# Altium project BYU SAE Formula E 2025.PrjPcb
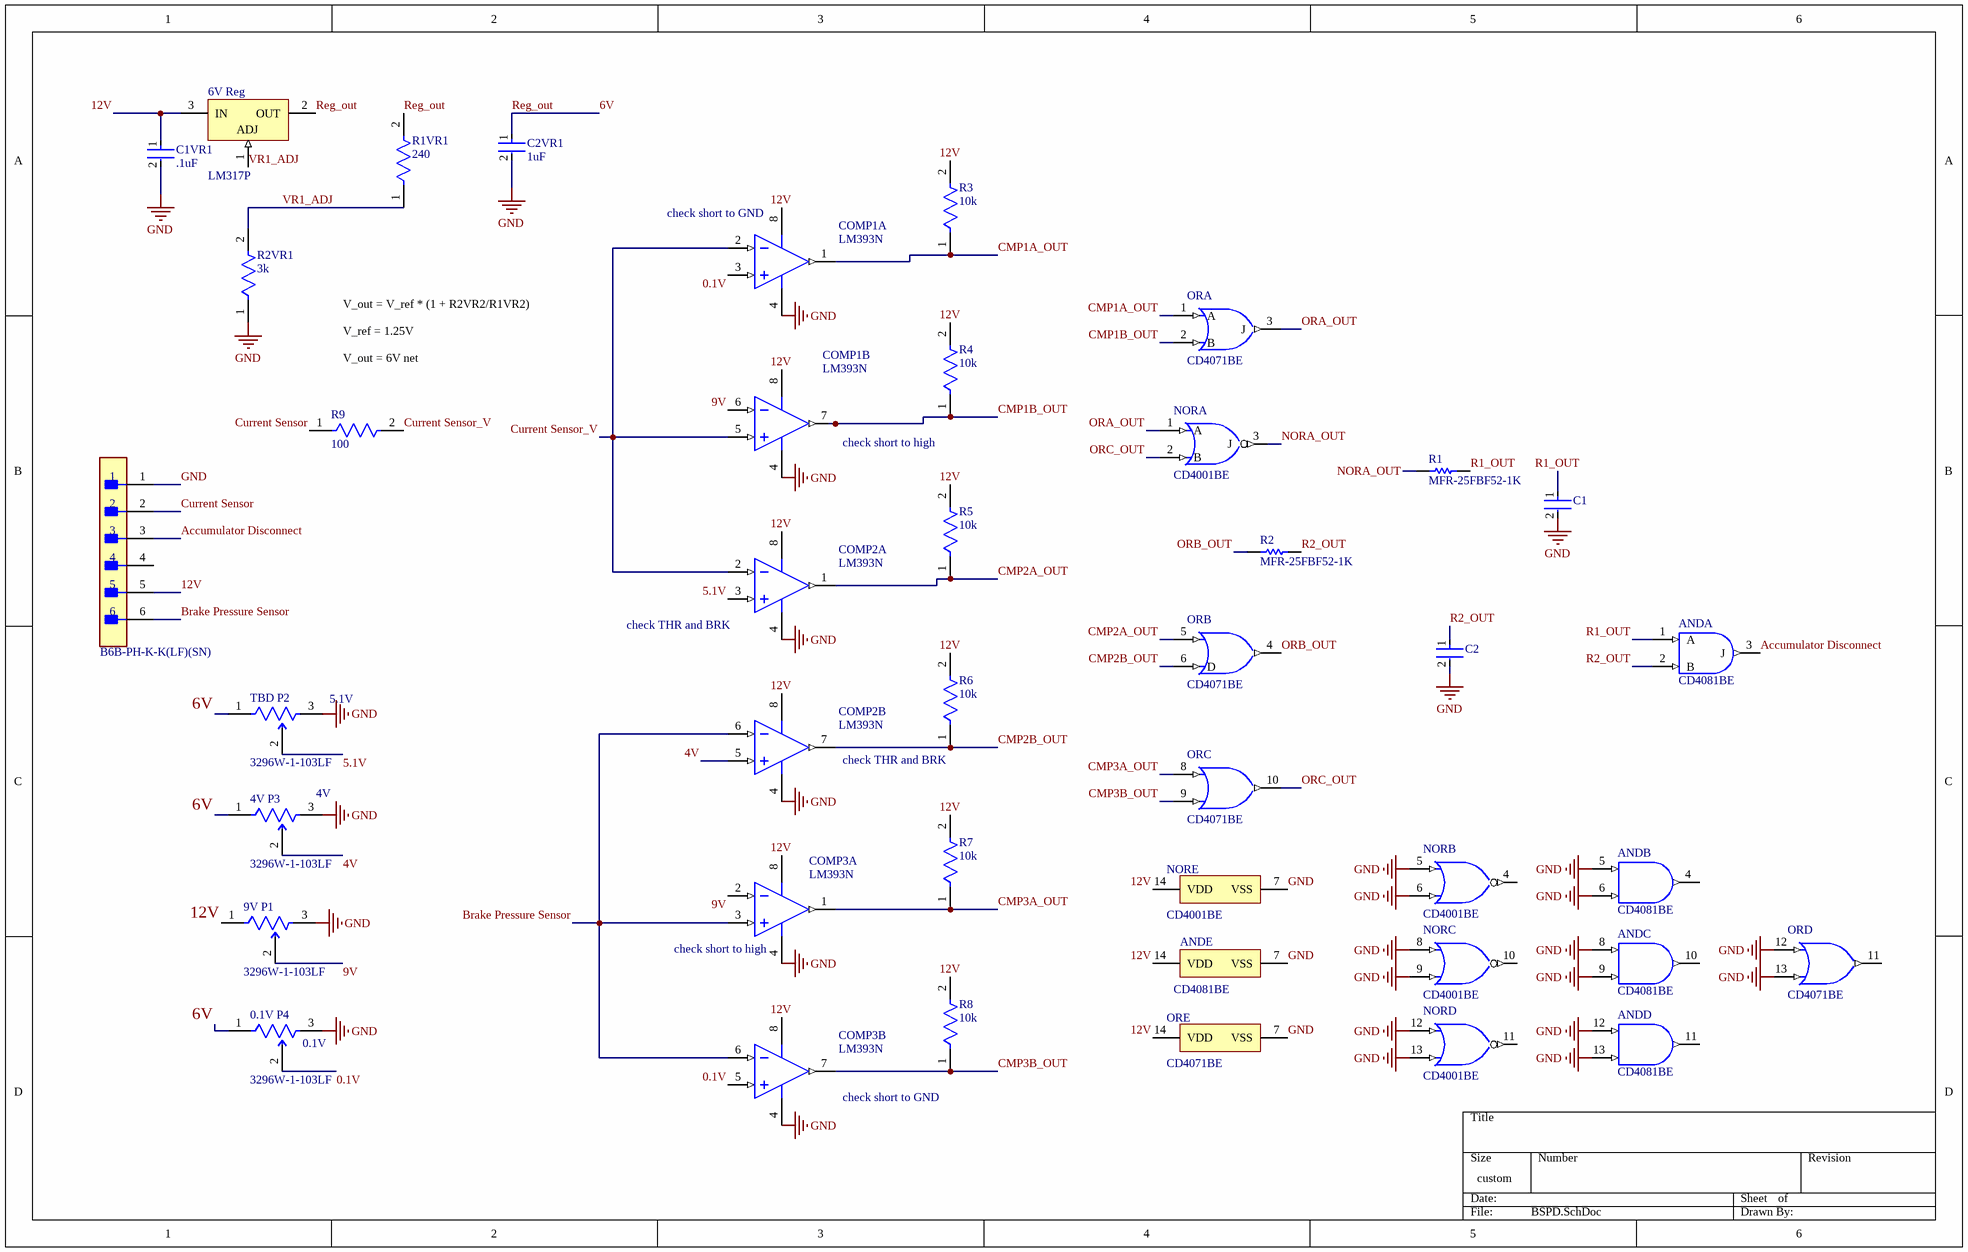
[diagram p0: BSPD.SchDoc]
6 sheets, 74 parts. Net scope: global (net labels, ports and power ports of the same name join across sheets).
Board file: BSPD.PcbDoc
Sheets:
  BSPD.SchDoc
  HotBox.SchDoc
  WOX.SchDoc
  DCF-ECU.SchDoc
  DCT.SchDoc
  DCR.SchDoc

## Sheet BSPD.SchDoc
size 368 x 233 mm; SheetNumber: 1; SheetTotal: 1

### Parts
(Parts that share a designator on the sheet are numbered #1, #2 ... from top to bottom, then left to right.)
0.1V_P4  3296W-1-103LF  [FP-3296W-MFG]
4V_P3  3296W-1-103LF  [FP-3296W-MFG]
6V_Reg  LM317P  [TO220FP]
9V_P1  3296W-1-103LF  [FP-3296W-MFG]
AND  CD4081BE  [N0014A]  (parts A,B,C,D,E of 5)
C1  RDER71H105K2M1H03A  [FP-RDE2M1-MFG]  (value not drawn)
C1VR1  .1uF  [FP-RDE1P1-MFG]
C2  RDER71H105K2M1H03A  [FP-RDE2M1-MFG]  (value not drawn)
C2VR1  1uF  [FP-RCE2K1-MFG]
COMP1  LM393N  [P0008A]  (parts A,B of 2)
COMP2  LM393N  [P0008A]  (parts A,B of 2)
COMP3  LM393N  [P0008A]  (parts A,B of 2)
NOR  CD4001BE  [N0014A]  (parts A,B,C,D,E of 5)
OR  CD4071BE  [N0014A]  (parts A,B,C,D,E of 5)
Plug#1  B6B-PH-K-K(LF)(SN)  [FP-B6B-PH-K-K_LF_SN-MFG]
R1#1  MFR-25FBF52-1K  [RESA60-630X240]
R1VR1  240  [FP-MRS25-MFG]
R2#1  MFR-25FBF52-1K  [RESA60-630X240]
R2VR1  3k  [FP-MRS25-MFG]
R3#1  10k  [FP-MRS25-MFG]
R4#1  10k  [FP-MRS25-MFG]
R5#1  10k  [FP-MRS25-MFG]
R6  10k  [FP-MRS25-MFG]
R7  10k  [FP-MRS25-MFG]
R8  10k  [FP-MRS25-MFG]
R9  100  [FP-MRS25-MFG]
TBD_P2  3296W-1-103LF  [FP-3296W-MFG]

### Nets
GND: 0.1V_P4.3(CW) 4V_P3.3(CW) 9V_P1.3(CW) AND.5(C) AND.6(D) AND.7(VSS) AND.8(E) AND.9(F) AND.12(G) AND.13(H) C1.2 C1VR1.2 C2.2 C2VR1.2 COMP1.4(GND) COMP2.4(GND) COMP3.4(GND) NOR.5(C) NOR.6(D) NOR.7(VSS) NOR.8(E) NOR.9(F) NOR.12(G) NOR.13(H) OR.7(VSS) OR.12(G) OR.13(H) Plug#1.1 R2VR1.1 TBD_P2.3(CW)
0.1V: 0.1V_P4.2(WIPER) COMP1.3(INA+) COMP3.5(INB+)
4V: 4V_P3.2(WIPER) COMP2.5(INB+)
5.1V: COMP2.3(INA+) TBD_P2.2(WIPER)
6V: 0.1V_P4.1(CCW) 4V_P3.1(CCW) 6V_Reg.2(OUT) C2VR1.1 R1VR1.2 TBD_P2.1(CCW)  [also labelled Reg_out]
9V: 9V_P1.2(WIPER) COMP1.6(INB-) COMP3.2(INA-)
12V: 6V_Reg.3(IN) 9V_P1.1(CCW) AND.14(VDD) C1VR1.1 COMP1.8(V+) COMP2.8(V+) COMP3.8(V+) NOR.14(VDD) OR.14(VDD) Plug#1.5 R3#1.2 R4#1.2 R5#1.2 R6.2 R7.2 R8.2
Accumulator Disconnect: AND.3(J) Plug#1.3
Brake Pressure Sensor: COMP2.6(INB-) COMP3.3(INA+) COMP3.6(INB-) Plug#1.6
CMP1A_OUT: COMP1.1(OUTA) OR.1(A) R3#1.1
CMP1B_OUT: COMP1.7(OUTB) OR.2(B) R4#1.1
CMP2A_OUT: COMP2.1(OUTA) OR.5(C) R5#1.1
CMP2B_OUT: COMP2.7(OUTB) OR.6(D) R6.1
CMP3A_OUT: COMP3.1(OUTA) OR.8(E) R7.1
CMP3B_OUT: COMP3.7(OUTB) OR.9(F) R8.1
Current Sensor: Plug#1.2 R9.1
Current Sensor_V: COMP1.2(INA-) COMP1.5(INB+) COMP2.2(INA-) R9.2
NORA_OUT: NOR.3(J) R1#1.1
ORA_OUT: NOR.1(A) OR.3(J)
ORB_OUT: OR.4(K) R2#1.1
ORC_OUT: NOR.2(B) OR.10(L)
R1_OUT: AND.1(A) C1.1 R1#1.2
R2_OUT: AND.2(B) C2.1 R2#1.2
VR1_ADJ: 6V_Reg.1(ADJ) R1VR1.1 R2VR1.2

Not connected (* = marked no-connect by the designer): AND 4(K) 10(L) 11(M); NOR 4(K) 10(L) 11(M); OR 11(M); Plug#1 4

### Notes on the sheet
- (near COMP1) check short to GND
- V_out = V_ref * (1 + R2VR2/R1VR2)
  V_ref = 1.25V
  V_out = 6V net
- check short to high
- (near COMP2) check THR and BRK
- (near TBD_P2) 5.1V
- (near 4V_P3) 4V
- check THR and BRK
- (near COMP3) check short to high
- (near 0.1V_P4) 0.1V
- check short to GND

### Library data of the parts
0.1V_P4 4V_P3 9V_P1 TBD_P2 = CMP-1747-00001-8: TRIMMER 10K OHM 0.5W PC PIN TOP; Number of Turns: 25; Tolerance: 10%; Resistance: 10kR; Max Power Dissipation: 500mW; Temperature Coefficient: 100ppm/°C; Insulation Resistance: 1GR; Min Operating Temperature: -55°C; Resistor Type: Cermet; Series: 3296; Color: Blue; Mount: Through Hole; Taper: Linear; Radiation Hardening: No; RoHS Compliant: Yes; Width: 9.53mm; Resistance Tolerance: 10%; Contact Plating: Tin; Military Standard: Not; Package Quantity: 50; Weight: 0.03oz; Lead Free: Lead Free; Power Rating: 500mW; Termination: Pin; Technology: CERMET; Max Operating Temperature: 125°C; Packaging: Rail/Tube; Length: 9.53mm; Depth: 4.83mm; Height: 11.55mm; Reach SVHC Compliant: Yes
6V_Reg = CMP-0244-00425-1: 1.5A, 1.2V to 37V Adjustable Voltage Regulator, 3-Pin TO-220FP; PackageVersion: 2011; PackageReference: TO220FP; ComponentLink2Description: Datasheet; ComponentLink1Description: Manufacturer URL; ComponentLink1URL: http://www.st.com; PackageDescription: TO, Thru-Hole, Vertical, Heatsink Mounted; 3 In-Line Leads; Pitch 2.54 mm; ComponentLink2URL: http://www.st.com/internet/com/TECHNICAL_RESOURCES/TECHNICAL_LITERATURE/DATASHEET/CD00000455.pdf; DatasheetVersion: 1/11/2011
AND = CMP-0777-00273-3: CMOS Quad 2-Input AND Gate, N0014A, TUBE; Manufacturer: Texas Instruments; F @ Nom Voltage(Max)(Mhz): 8; Bits(#): 4; VCC(Min)(V): 3; tpd @ Nom Voltage(Max)(ns): 12; VCC(Max)(V): 18; Output Drive (IOL/IOH)(Max)(mA): -6.8/6.8; Rating: Military; Voltage(Nom)(V): 10; Schmitt Trigger: No; ICC @ Nom Voltage(Max)(mA): 0.015; Technology Family: CD4000; DatasheetVersion: SCHS057C; Operating Temperature Range(C): -55 to 125; PackageReference: N0014A; Output Type: CMOS; Generic Part Number: CD4081B; Input Type: CMOS
C1 C2 = CMP-06035-045612-1: Ceramic Capacitor 1uF ±10% 50V X7R Radial; Lead Diameter: 0.5mm; Lead/Base Style: Kinked; Height - Seated (Max): 0.236inch; Tolerance: 10%; Height: 4mm; Package Quantity: 2000; Termination: Radial; Voltage Rating: 50V; Width: 4mm; Voltage Rating (DC): 50V; Lead Free: Lead Free; Case/Package: Radial; Length: 0.217inch; Mount: Through Hole; Dielectric: X7R; Packaging: Tape and Reel; Min Operating Temperature: -55°C; Max Operating Temperature: 125°C; Lead Pitch: 0.197inch; Capacitance: 1uF; Resistor Type: Ceramic
C1VR1 = CMP-06035-033965-1: Ceramic Capacitor 100nF ±10% 100V X7R Radial; Lead/Base Style: Formed Leads; Lead Diameter: 0.5mm; Voltage Rating (DC): 100V; Case/Package: Radial; Capacitance: 100nF; Lead Pitch: 0.098inch; Resistor Type: Ceramic; Tolerance: 10%; Max Operating Temperature: 125°C; Dielectric: X7R; Height - Seated (Max): 0.197inch; Voltage Rating: 100V; Lead Free: Lead Free; Height: 3.5mm; Length: 0.177inch; Packaging: Tape and Reel; Package Quantity: 1; Width: 0.124inch; Mount: Through Hole; Termination: Radial; Min Operating Temperature: -55°C
C2VR1 = CMP-06035-007361-1: Cap Ceramic Monolithic 1uF 100V 10% Thru-Hole Bulk; Lead Diameter: 0.5mm; Lead/Base Style: Formed Leads; Dielectric: X7R; Voltage Rating (DC): 100V; Tolerance: 10%; Width: 0.124inch; Termination: Radial; Length: 0.217inch; Height: 4mm; Ratings: AEC-Q200; Package Quantity: 2000; Mount: Through Hole; Height - Seated (Max): 0.157inch; Case/Package: Radial; Resistor Type: Ceramic; Lead Pitch: 0.197inch; Lead Free: Lead Free; Packaging: Tape and Reel; Voltage Rating: 100V; Min Operating Temperature: -55°C; Max Operating Temperature: 125°C; Capacitance: 1uF
COMP1-COMP3 = CMP-0055-00119-3: Low Power Low Offset Voltage Dual Comparator, 8-pin MDIP; Manufacturer: Texas Instruments; PackageTopMarking: NSUZXYTTE#*LM*393N; CompType: Amplifiers; PowerWise: N; Code_JEDEC: MS-001-BA; ComponentLink1URL: http://www.ti.com/general/docs/lit/getliterature.tsp?genericPartNumber=LM393-N&fileType=pdf; ComponentLink1Description: Datasheet URL; PackageDescription: MDIP, .365 x .250 x .130in, 8 Lead, .100in Pitch; RoHS: N; PinCount: 8; Package Reference: P0008A
NOR = CMP-0806-00193-3: CMOS Quad 2-Input NOR Gate, N0014A, TUBE; Manufacturer: Texas Instruments; VCC(Max)(V): 18; Rating: Military; Bits(#): 4; VCC(Min)(V): 3; tpd @ Nom Voltage(Max)(ns): 120; F @ Nom Voltage(Max)(Mhz): 8; ICC @ Nom Voltage(Max)(mA): 0.015; Output Drive (IOL/IOH)(Max)(mA): 1.5/-1.5; Voltage(Nom)(V): 10; Input Type: CMOS; Code_JEDEC: MS-001; DatasheetVersion: SCHS015C; Output Type: CMOS; Generic Part Number: CD4001B; PackageVersion: http://www.ti.com/lit/ml/mpdi002c/mpdi002c.pdf; PackageReference: N0014A; Operating Temperature Range(C): -55 to 125
OR = CMP-1573-00144-3: CMOS Quad 2-Input OR Gate, N0014A, TUBE; Manufacturer: Texas Instruments; Voltage(Nom)(V): 10; F @ Nom Voltage(Max)(Mhz): 8; ICC @ Nom Voltage(Max)(mA): 0.015; Rating: Military; Bits(#): 4; VCC(Min)(V): 3; tpd @ Nom Voltage(Max)(ns): 120; VCC(Max)(V): 18; Output Drive (IOL/IOH)(Max)(mA): 1.5/-1.5; PackageReference: N0014A; Code_JEDEC: MS-001; PackageVersion: http://www.ti.com/lit/ml/mpdi002c/mpdi002c.pdf; DatasheetVersion: SCHS056D; Output Type: CMOS; Generic Part Number: CD4071B; Input Type: CMOS; Operating Temperature Range(C): -55 to 125
Plug#1 = CMP-17439-000495-1: PH Series 6 Position 2 mm Pitch Through Hole Top Entry Shrouded Header; Lead Free: Lead Free
R1#1 R2#1 = CMP-1659-00075-1: Axial Resistor, 1 KOhm, +/- 1%, 250 mW, -55 to 155 degC, 2-Pin THD, RoHS, Bulk; Voltage Rating: 250 V; Resistance: 10 kohm; Power Rating: 250 mW; ComponentLink2Description: Datasheet; RoHSCompliant: true; PackageReference: MFR-25; Case\Package: Axial; Max Operating Temperature: 155 degC; DatasheetVersion: Apr-13; Tolerance: 1%; ComponentLink1URL: http://www.yageo.com/; Length: 0.248 inch; ComponentLink2URL: http://www.yageo.com/documents/recent/Yageo%20LR_MFR_2013.pdf; Packaging: Bulk; Package Quantity: 200; PackageDescription: 2-Pin Axial Lead, Dia 2.4 mm, Body Length 6.3 mm; Min Operating Temperature: -55 degC; ComponentLink1Description: Manufacturer URL
R1VR1 R2VR1 R3#1 R4#1 R5#1 R6-R9 = CMP-00030-42757237-1: MRS25000C1000FRP00 Resistor, 100 Ohm, ± 1%, 600 mW, Axial Leaded, Metal Film (Thin Film), Professional; Max Power Dissipation: 600mW; Resistance: 100Ω; Voltage Rating: 350V; Temperature Coefficient: 50ppm/°C; Lead Diameter: 600µm; RoHS: Compliant; Radiation Hardening: No; Schedule B: 8533210090, 8533210090; Length: 6.5mm; Packaging: Tape & Reel (TR); Number of Terminations: 2; Mount: Through Hole; Width: 2.5mm; Tolerance: 1%; Military Standard: Not; Voltage Rating (DC): 350V; Contact Plating: Tin; Number of Pins: 2; Max Operating Temperature: 155°C; NexarPartId: 42757237; Diameter: 2.5mm; Composition: Metal Film, Thin Film; REACH SVHC: Unknown; Power Rating: 600mW; Lead Free: Lead Free; Termination: Axial; Case/Package: Axial; Min Operating Temperature: -55°C

## Sheet HotBox.SchDoc
size A2; SheetNumber: 1; SheetTotal: 1
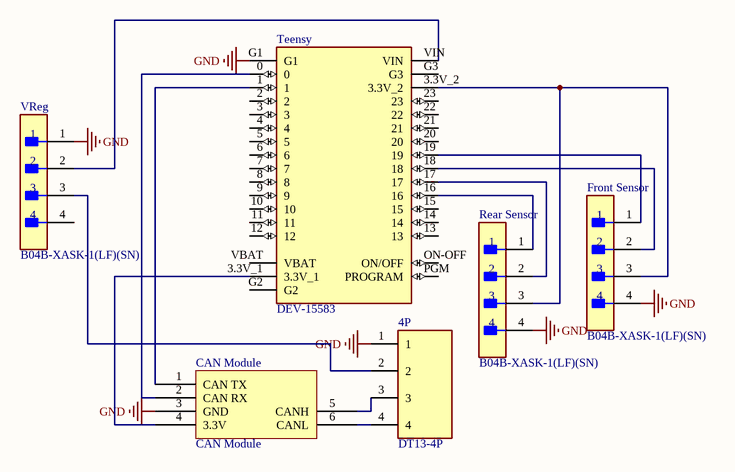
[diagram p1: HotBox.SchDoc]

### Parts
(Parts that share a designator on the sheet are numbered #1, #2 ... from top to bottom, then left to right.)
4P#1  DT13-4P  [TE_DT13-4P]
CAN_Module#1  CAN Module  [CAN Module-Footprint-1]
Front_Sensor  B04B-XASK-1(LF)(SN)  [FP-B04B-XASK-1_LF_SN-MFG]
Rear_Sensor  B04B-XASK-1(LF)(SN)  [FP-B04B-XASK-1_LF_SN-MFG]
Teensy#1  DEV-15583  [MODULE_DEV-15583]
VReg#1  B04B-XASK-1(LF)(SN)  [FP-B04B-XASK-1_LF_SN-MFG]

### Nets
GND: 4P#1.1 CAN_Module#1.3(GND) Front_Sensor.4 Rear_Sensor.4 Teensy#1.G1 VReg#1.1
Net4P#1_2: 4P#1.2 VReg#1.3
Net4P#1_3: 4P#1.3 CAN_Module#1.5(CANH)
Net4P#1_4: 4P#1.4 CAN_Module#1.6(CANL)
NetCAN_Module#1_1: CAN_Module#1.1(CAN_TX) Teensy#1.1
NetCAN_Module#1_2: CAN_Module#1.2(CAN_RX) Teensy#1.0
NetCAN_Module#1_4: CAN_Module#1.4(3.3V) Teensy#1.3.3V_1
NetFront_Sensor_1: Front_Sensor.1 Teensy#1.19
NetFront_Sensor_2: Front_Sensor.2 Teensy#1.18
NetFront_Sensor_3: Front_Sensor.3 Rear_Sensor.3 Teensy#1.3.3V_2
NetRear_Sensor_1: Rear_Sensor.1 Teensy#1.16
NetRear_Sensor_2: Rear_Sensor.2 Teensy#1.17
NetTeensy#1_VIN: Teensy#1.VIN VReg#1.2

Not connected (* = marked no-connect by the designer): Teensy#1 2 3 4 5 6 7 8 9 10 11 12 13 14 15 20 21 22 23 G2 G3 ON-OFF(ON/OFF) PGM(PROGRAM) VBAT; VReg#1 4

### Library data of the parts
4P#1 = DT13-4P: DT13 Series, 4.44mm Pitch 4 Way 2 Row Right Angle PCB Header, Solder Termination; MF: TE Connectivity; SnapEDA_Link: https://www.snapeda.com/parts/DT13-4P/TE%20Connectivity%20Deutsch%20Connectors/view-part/2708791/?ref=snap; MP: DT13-4P; TE_purchase_URL: https://www.te.com/usa-en/product-DT13-4P.html?te_bu=Cor&te_type=disp&te_campaign=seda_glo_cor-seda-global-disp-prtnr-fy19-seda-model-bom-cta_sma-317_1&elqCampaignId=32493; Availability: Unavailable; Value: *; Price: None; Package: None
CAN_Module#1 = CMP-00030-00003-1: CAN waveshare
Front_Sensor Rear_Sensor VReg#1 = CMP-17439-000018-1: CONN HEADER VERT 4POS 2.5MM; Manufacturer: JST; Current Rating: 3A; Voltage Rating: 250V; Conn Orientation: Straight; Conn Gender: Male; Number Of Contacts: 4; ComponentLink2Description: Datasheet; Package: B04B-XASK-1(LF)(SN); Octopart: https://octopart.com/b04b-xask-1%28lf%29%28sn%29-jst-3990149; Pitch: 2.5mm; Device Class L1: Connectors; RoHS: TRUE; Device Class L3: unset; Manufacturer Part Number: B04B-XASK-1(LF)(SN); Temperature Range High: +85°C; Height: 8.8mm; Lead Free: Yes; Category: Conn; Temperature: -25°C to +85°C; Digikey Description: CONN HEADER VERT 4POS 2.5MM; Temperature Range Low: -25°C; ComponentLink2URL: http://www.jst-mfg.com/product/pdf/eng/eXA1.pdf; Contact Material: Tin,Copper; Device Class L2: Headers and Wire Housings; Automotive: No; Number Of Rows: 1
Teensy#1 = DEV-15583: RT1062 Teensy 4.0 i.MX ARMÂ® CortexÂ®-M7 MPU Embedded Evaluation Board; MF: SparkFun Electronics; Value: *; Package: None; Digi-Key_Part_Number: 1568-DEV-15583-ND; Digi-Key_Purchase_URL: https://www.digikey.com/product-detail/en/sparkfun-electronics/DEV-15583/1568-DEV-15583-ND/10384551?utm_source=snapeda&utm_medium=aggregator&utm_campaign=symbol; MP: DEV-15583; SnapEDA_Link: https://www.snapeda.com/parts/DEV-15583/SparkFun%20Electronics/view-part/4001229/?ref=snap

## Sheet WOX.SchDoc
size A3; SheetNumber: 1; SheetTotal: 1
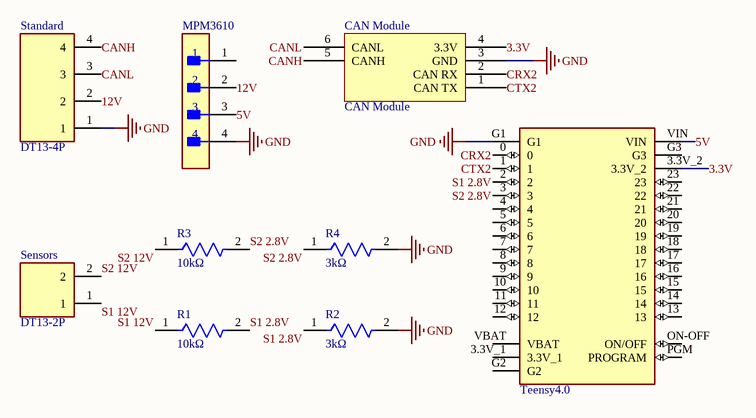
[diagram p2: WOX.SchDoc]

### Parts
(Parts that share a designator on the sheet are numbered #1, #2 ... from top to bottom, then left to right.)
CAN_Module#2  CAN Module  [CAN Module-Footprint-1]
MPM3610  B04B-XASK-1(LF)(SN)  [FP-B04B-XASK-1_LF_SN-MFG]  (value not drawn)
R1#2  10kΩ  [FP-RLR07-MFG]
R2#2  3kΩ  [FP-RNC65-MFG]
R3#2  10kΩ  [FP-RLR07-MFG]
R4#2  3kΩ  [FP-RNC65-MFG]
Sensors  DT13-2P  [TE_DT13-2P]
Standard  DT13-4P  [TE_DT13-4P]
Teensy4.0#1  DEV-15583  [MODULE_DEV-15583]  (value not drawn)

### Nets
GND: CAN_Module#2.3(GND) MPM3610.4 R2#2.2 R4#2.2 Standard.1 Teensy4.0#1.G1
3.3V: CAN_Module#2.4(3.3V) Teensy4.0#1.3.3V_2
5V: MPM3610.3 Teensy4.0#1.VIN
12V: MPM3610.2 Standard.2
CANH: CAN_Module#2.5(CANH) Standard.4
CANL: CAN_Module#2.6(CANL) Standard.3
CRX2: CAN_Module#2.2(CAN_RX) Teensy4.0#1.0
CTX2: CAN_Module#2.1(CAN_TX) Teensy4.0#1.1
S1 2.8V: R1#2.2 R2#2.1 Teensy4.0#1.2
S1 12V: R1#2.1 Sensors.1
S2 2.8V: R3#2.2 R4#2.1 Teensy4.0#1.3
S2 12V: R3#2.1 Sensors.2

Not connected (* = marked no-connect by the designer): MPM3610 1; Teensy4.0#1 3.3V_1 4 5 6 7 8 9 10 11 12 13 14 15 16 17 18 19 20 21 22 23 G2 G3 ON-OFF(ON/OFF) PGM(PROGRAM) VBAT

### Library data of the parts
CAN_Module#2 = CMP-00030-00003-1: CAN waveshare
MPM3610 = CMP-17439-000018-1: as Front_Sensor on sheet HotBox; ComponentLink2Description: Datasheet; Package: B04B-XASK-1(LF)(SN); Octopart: https://octopart.com/b04b-xask-1%28lf%29%28sn%29-jst-3990149; Pitch: 2.5mm; Device Class L1: Connectors; RoHS: TRUE; Device Class L3: unset; Manufacturer Part Number: B04B-XASK-1(LF)(SN); Temperature Range High: +85°C; Height: 8.8mm; Lead Free: Yes; Category: Conn; Temperature: -25°C to +85°C; Digikey Description: CONN HEADER VERT 4POS 2.5MM; Temperature Range Low: -25°C; ComponentLink2URL: http://www.jst-mfg.com/product/pdf/eng/eXA1.pdf; Contact Material: Tin,Copper; Device Class L2: Headers and Wire Housings; Automotive: No; Number Of Rows: 1
R1#2 R3#2 = CMP-00030-39449004-1: RLR07C1002FSB14 Fixed Resistor, Metal Film, 0.25W, 10000ohm, 250V, 1% +/-Tol, 100ppm/Cel, Through Hole Mount; Power Rating: 250mW; Lead Diameter: 640µm; Wire/Cable Diameter: 50.8µm; Lead Length: 38.1mm; Temperature Coefficient: 100ppm/°C; Military Standard: MIL-PRF-39017; Max Operating Temperature: 150°C; Width: 2.29mm; Mount: Through Hole; Composition: Metal Film; REACH SVHC: Unknown; Tolerance: 1%; Failure Rate: 0.001%; Min Operating Temperature: -65°C; Voltage Rating: 250V; Schedule B: 8533210090, 8533210090; Max Power Dissipation: 250mW; Length: 7.62mm; Case/Package: Conformal; Lead Free: Contains Lead; NexarPartId: 39449004; Radiation Hardening: No; Resistance: 10kΩ; Termination: Axial; Number of Pins: 14; RoHS: Non-Compliant; Packaging: Bulk; Features: Military, Moisture Resistant, Weldable; Number of Terminations: 2; Contact Plating: Lead, Tin; Diameter: 2.29mm; Voltage Rating (DC): 250V
R2#2 R4#2 = CMP-02408-000008-1: Res Metal Film 3.01K Ohm 1% 0.5W(1/2W) ±50ppm/C 0.01% Epoxy AXL T/R; Manufacturer Part Number: RNC65H3011FRB14; Manufacturer: Vishay; Resistance: 3.01kΩ; Voltage Rating: 300V; Value: 3.01kΩ; Temperature Coefficient: 50ppm/°C; Device Class L3: Through-Hole Resistors; Temperature Range High: +175°C; Tolerance: 1%; Military Standard: true; Device Class L2: Resistors; Temperature: -65°C to +175°C; Lead Free: Yes; Category: Res; RoHS: TRUE; Series: RNC; Temperature Range Low: -65°C; Package: RNC65; Octopart: https://octopart.com/rnc65h3011frb14-vishay-40281131; ComponentLink2Description: Datasheet; Composition: Metal Film; Device Class L1: Passive Components; Height: 4.95mm; Ipc Land Pattern Name: RESAD2083W85L1745D495; Automotive: No; ComponentLink2URL: https://www.vishay.com/docs/31025/erc.pdf; Power Rating: 0.5W
Sensors = DT13-2P: DT13 Series, 5.46mm Pitch 2 Way 1 Row Right Angle PCB Header, Solder Termination; MF: TE Connectivity; Value: *; Price: None; Package: None; Availability: Unavailable; SnapEDA_Link: https://www.snapeda.com/parts/DT13-2P/TE%20Connectivity%20Deutsch%20Connectors/view-part/1788306/?ref=snap; EU_RoHS_Compliance: Compliant; DigiKey-Purchase-URL: https://snapeda.com/shop?store=DigiKey&id=1788306; MP: DT13-2P
Standard = DT13-4P: as 4P#1 on sheet HotBox; SnapEDA_Link: https://www.snapeda.com/parts/DT13-4P/TE%20Connectivity%20Deutsch%20Connectors/view-part/2708791/?ref=snap; MP: DT13-4P; TE_purchase_URL: https://www.te.com/usa-en/product-DT13-4P.html?te_bu=Cor&te_type=disp&te_campaign=seda_glo_cor-seda-global-disp-prtnr-fy19-seda-model-bom-cta_sma-317_1&elqCampaignId=32493; Availability: Unavailable; Value: *; Price: None; Package: None
Teensy4.0#1 = DEV-15583: as Teensy#1 on sheet HotBox; Value: *; Package: None; Digi-Key_Part_Number: 1568-DEV-15583-ND; Digi-Key_Purchase_URL: https://www.digikey.com/product-detail/en/sparkfun-electronics/DEV-15583/1568-DEV-15583-ND/10384551?utm_source=snapeda&utm_medium=aggregator&utm_campaign=symbol; MP: DEV-15583; SnapEDA_Link: https://www.snapeda.com/parts/DEV-15583/SparkFun%20Electronics/view-part/4001229/?ref=snap

## Sheet DCF-ECU.SchDoc
size A3; SheetNumber: 1; SheetTotal: 1
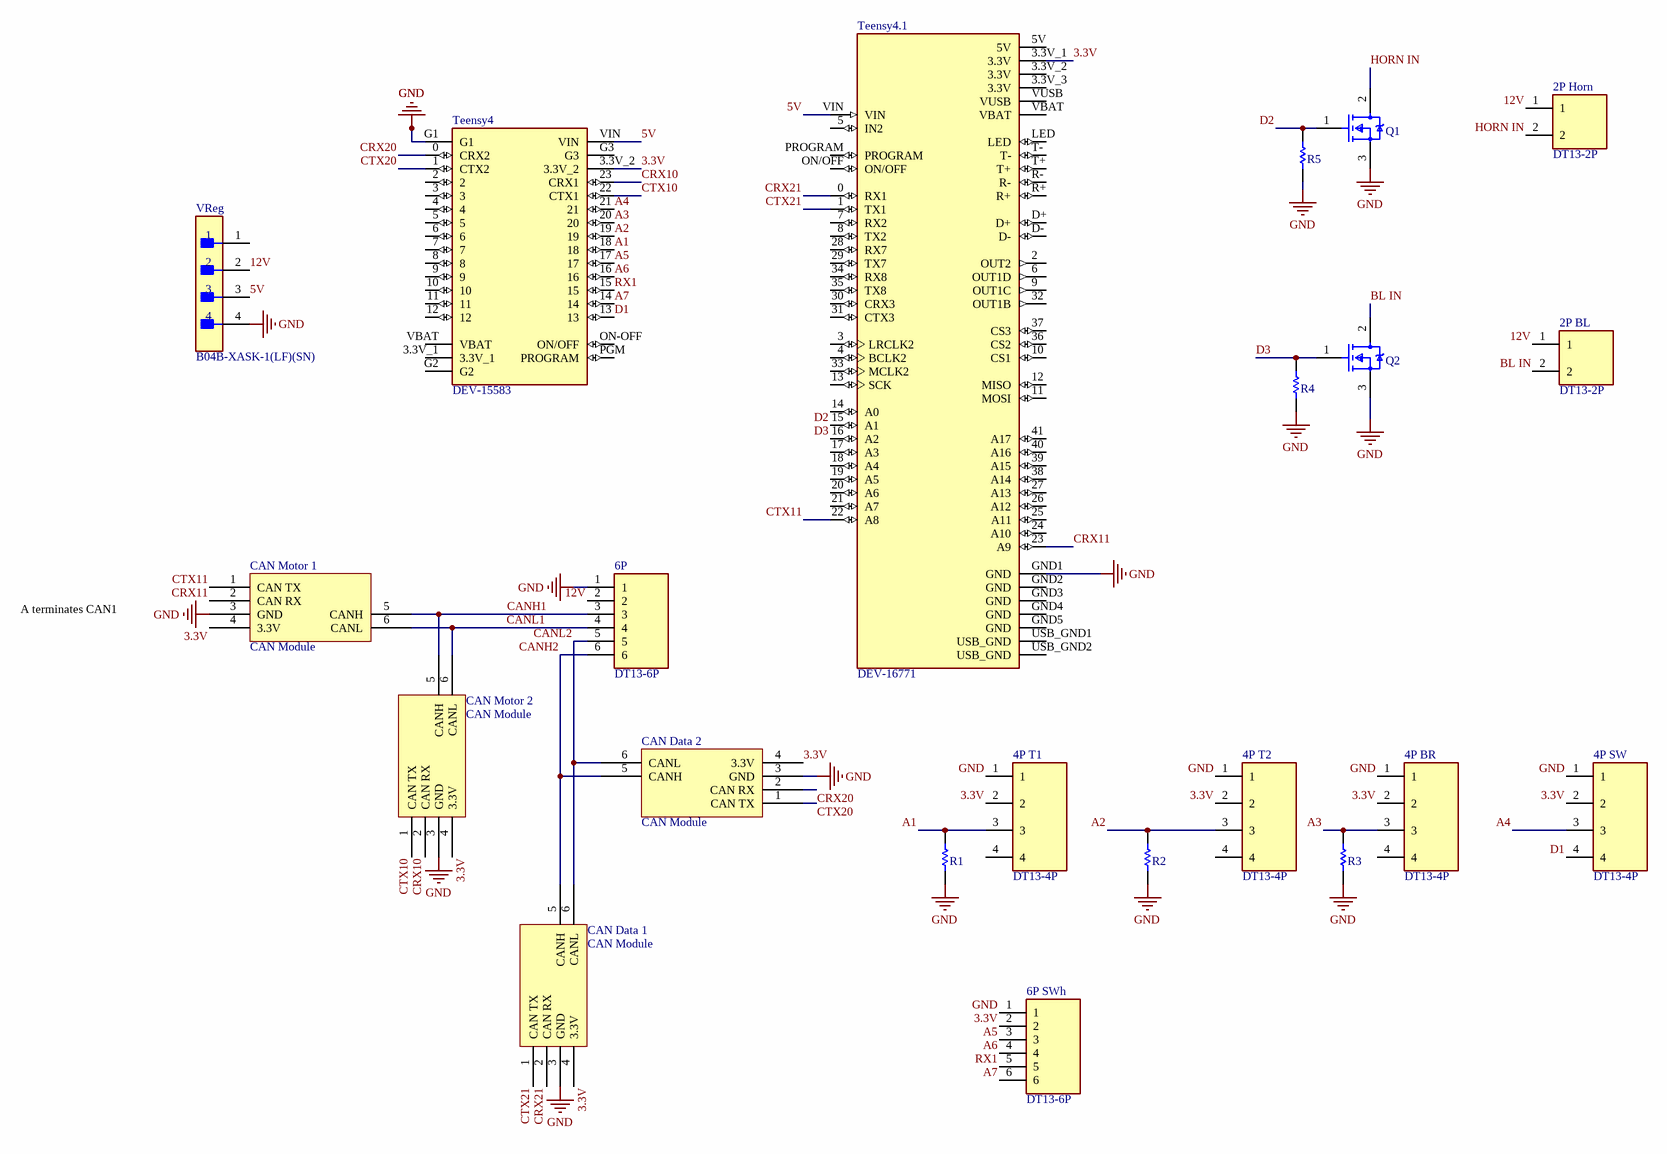
[diagram p3: DCF-ECU.SchDoc]

### Parts
(Parts that share a designator on the sheet are numbered #1, #2 ... from top to bottom, then left to right.)
2P_BL  DT13-2P  [TE_DT13-2P]
2P_Horn  DT13-2P  [TE_DT13-2P]
4P_BR  DT13-4P  [TE_DT13-4P]
4P_SW  DT13-4P  [TE_DT13-4P]
4P_T1  DT13-4P  [TE_DT13-4P]
4P_T2  DT13-4P  [TE_DT13-4P]
6P  DT13-6P  [TE_DT13-6P]
6P_SWh  DT13-6P  [TE_DT13-6P]
CAN_Data_1  CAN Module  [CAN Module-Footprint-1]
CAN_Data_2  CAN Module  [CAN Module-Footprint-1]
CAN_Motor_1  CAN Module  [CAN Module-Footprint-1]
CAN_Motor_2  CAN Module  [CAN Module-Footprint-1]
Q1  IRLZ44NPbF  [FP-PG-TO220-3-MFG]  (value not drawn)
Q2  IRLZ44NPbF  [FP-PG-TO220-3-MFG]  (value not drawn)
R1#3  MFR-25FBF5210K  [RESA60-630X240]  (value not drawn)
R2#3  MFR-25FBF5210K  [RESA60-630X240]  (value not drawn)
R3#3  MFR-25FBF5210K  [RESA60-630X240]  (value not drawn)
R4#3  MFR-25FBF5210K  [RESA60-630X240]  (value not drawn)
R5#2  MFR-25FBF5210K  [RESA60-630X240]  (value not drawn)
Teensy4  DEV-15583  [MODULE_DEV-15583]
Teensy4.1  DEV-16771  [MODULE_DEV-16771]
VReg#2  B04B-XASK-1(LF)(SN)  [FP-B04B-XASK-1_LF_SN-MFG]

### Nets
GND: 4P_BR.1 4P_SW.1 4P_T1.1 4P_T2.1 6P.1 6P_SWh.1 CAN_Data_1.3(GND) CAN_Data_2.3(GND) CAN_Motor_1.3(GND) CAN_Motor_2.3(GND) Q1.3(S) Q2.3(S) R1#3.1 R2#3.1 R3#3.1 R4#3.1 R5#2.1 Teensy4.G1 Teensy4.1.GND1(GND) VReg#2.4
3.3V: 4P_BR.2 4P_SW.2 4P_T1.2 4P_T2.2 6P_SWh.2 CAN_Data_1.4(3.3V) CAN_Data_2.4(3.3V) CAN_Motor_1.4(3.3V) CAN_Motor_2.4(3.3V) Teensy4.3.3V_2 Teensy4.1.3.3V_1(3.3V)
5V: Teensy4.VIN Teensy4.1.VIN VReg#2.3
12V: 2P_BL.1 2P_Horn.1 6P.2 VReg#2.2
A1: 4P_T1.3 R1#3.2 Teensy4.18
A2: 4P_T2.3 R2#3.2 Teensy4.19
A3: 4P_BR.3 R3#3.2 Teensy4.20
A4: 4P_SW.3 Teensy4.21
A5: 6P_SWh.3 Teensy4.17
A6: 6P_SWh.4 Teensy4.16
A7: 6P_SWh.6 Teensy4.14
BL IN: 2P_BL.2 Q2.2(D)
CANH1: 6P.3 CAN_Motor_1.5(CANH) CAN_Motor_2.5(CANH)
CANH2: 6P.6 CAN_Data_1.5(CANH) CAN_Data_2.5(CANH)
CANL1: 6P.4 CAN_Motor_1.6(CANL) CAN_Motor_2.6(CANL)
CANL2: 6P.5 CAN_Data_1.6(CANL) CAN_Data_2.6(CANL)
CRX10: CAN_Motor_2.2(CAN_RX) Teensy4.23(CRX1)
CRX11: CAN_Motor_1.2(CAN_RX) Teensy4.1.23(A9)
CRX20: CAN_Data_2.2(CAN_RX) Teensy4.0(CRX2)
CRX21: CAN_Data_1.2(CAN_RX) Teensy4.1.0(RX1)
CTX10: CAN_Motor_2.1(CAN_TX) Teensy4.22(CTX1)
CTX11: CAN_Motor_1.1(CAN_TX) Teensy4.1.22(A8)
CTX20: CAN_Data_2.1(CAN_TX) Teensy4.1(CTX2)
CTX21: CAN_Data_1.1(CAN_TX) Teensy4.1.1(TX1)
D1: 4P_SW.4 Teensy4.13
D2: Q1.1(G) R5#2.2 Teensy4.1.15(A1)
D3: Q2.1(G) R4#3.2 Teensy4.1.16(A2)
HORN IN: 2P_Horn.2 Q1.2(D)
RX1: 6P_SWh.5 Teensy4.15

Not connected (* = marked no-connect by the designer): 4P_BR 4; 4P_T1 4; 4P_T2 4; Teensy4 2 3 3.3V_1 4 5 6 7 8 9 10 11 12 G2 G3 ON-OFF(ON/OFF) PGM(PROGRAM) VBAT; Teensy4.1 2(OUT2) 3(LRCLK2) 3.3V_2(3.3V) 3.3V_3(3.3V) 4(BCLK2) 5(IN2) 5V 6(OUT1D) 7(RX2) 8(TX2) 9(OUT1C) 10(CS1) 11(MOSI) 12(MISO) 13(SCK) 14(A0) 17(A3) 18(A4) 19(A5) 20(A6) 21(A7) 24(A10) 25(A11) 26(A12) 27(A13) 28(RX7) 29(TX7) 30(CRX3) 31(CTX3) 32(OUT1B) 33(MCLK2) 34(RX8) 35(TX8) 36(CS2) 37(CS3) 38(A14) 39(A15) 40(A16) 41(A17) D+ D- GND2(GND) GND3(GND) GND4(GND) GND5(GND) LED ON/OFF PROGRAM R+ R- T+ T- USB_GND1(USB_GND) USB_GND2(USB_GND) VBAT VUSB; VReg#2 1

### Notes on the sheet
- A terminates CAN1

### Library data of the parts
2P_BL 2P_Horn = DT13-2P: as Sensors on sheet WOX; Value: *; Price: None; Package: None; Availability: Unavailable; SnapEDA_Link: https://www.snapeda.com/parts/DT13-2P/TE%20Connectivity%20Deutsch%20Connectors/view-part/1788306/?ref=snap; EU_RoHS_Compliance: Compliant; DigiKey-Purchase-URL: https://snapeda.com/shop?store=DigiKey&id=1788306; MP: DT13-2P
4P_BR 4P_SW 4P_T1 4P_T2 = DT13-4P: as 4P#1 on sheet HotBox; SnapEDA_Link: https://www.snapeda.com/parts/DT13-4P/TE%20Connectivity%20Deutsch%20Connectors/view-part/2708791/?ref=snap; MP: DT13-4P; TE_purchase_URL: https://www.te.com/usa-en/product-DT13-4P.html?te_bu=Cor&te_type=disp&te_campaign=seda_glo_cor-seda-global-disp-prtnr-fy19-seda-model-bom-cta_sma-317_1&elqCampaignId=32493; Availability: Unavailable; Value: *; Price: None; Package: None
6P 6P_SWh = DT13-6P: DT13 Series, 4.44mm Pitch 6 Way 2 Row Right Angle PCB Header, Solder Termination; MF: TE Connectivity; DigiKey-Purchase-URL: https://snapeda.com/shop?store=DigiKey&id=1897474; Value: *; SnapEDA_Link: https://www.snapeda.com/parts/DT13-6P/TE%20Connectivity%20Deutsch%20Connectors/view-part/1897474/?ref=snap; EU_RoHS_Compliance: Compliant; Availability: Unavailable; Price: None; Package: None; MP: DT13-6P
CAN_Data_1 CAN_Data_2 CAN_Motor_1 CAN_Motor_2 = CMP-00030-00003-1: CAN waveshare
Q1 Q2 = CMP-32901-000488-1: MOSFET N-CH 55V 47A TO220AB; Turn-On Delay Time: 11ns; Gate to Source Voltage (Vgs): 16V; Element Configuration: Single; Rds On Max: 22mR; Turn-Off Delay Time: 26ns; Max Power Dissipation: 110W; Threshold Voltage: 2V; Drain to Source Resistance: 35mR; Input Capacitance: 1.7nF; Continuous Drain Current (ID): 47A; Case/Package: TO-220; Lead Free: Lead Free; Halogen Free: Halogen Free; Packaging: Rail/Tube; Length: 0.414inch; Min Operating Temperature: -55°C; REACH SVHC: No SVHC; Number of Pins: 3; Width: 0.185inch; Drain to Source Voltage (Vdss): 55V; Power Dissipation: 110W; RoHS Compliant: Yes; Max Operating Temperature: 175°C; Height: 0.6inch; Max Dual Supply Voltage: 55V; Drain to Source Breakdown Voltage: 55V; Mount: Through Hole
R1#3 R2#3 R3#3 R4#3 R5#2 = CMP-1659-00074-2: Axial Resistor, 10 KOhm, +/- 1%, 0.25 W, -55 to 155 degC, 2-Pin THD, RoHS, Bulk; Manufacturer: Yageo; Temperature Coefficient: 100ppm\/degreesC; Voltage Rating: 250V; Voltage Rating (DC): 200V; Resistance: 10KOhm; Max Power Dissipation: 250mW; Datasheet URL: http://www.yageo.com/documents/recent/Yageo%20LR_MFR_2013.pdf; Packaging: Bulk; RoHSCompliant: True; Mount: ThroughHole; Package Reference: MFR-25; Termination: Axial; Composition: MetalFilm; Number of Terminations: 2; Package Quantity: 200; Mounting Technology: ThroughHole; Length: 0.248inch; Max Operating Temperature: 155degC; Min Operating Temperature: -55degC; Datasheet Version: 04/2013; Lead Free: LeadFree; Manufacturer URL: http://www.yageo.com/; Tolerance: 1%; Power Rating: 250mW; Package Description: 2-Pin Axial Lead, Dia 2.4 mm, Body Length 6.3 mm; Military Standard: Not; Case\/Package: Axial
Teensy4 = DEV-15583: as Teensy#1 on sheet HotBox; Value: *; Package: None; Digi-Key_Part_Number: 1568-DEV-15583-ND; Digi-Key_Purchase_URL: https://www.digikey.com/product-detail/en/sparkfun-electronics/DEV-15583/1568-DEV-15583-ND/10384551?utm_source=snapeda&utm_medium=aggregator&utm_campaign=symbol; MP: DEV-15583; SnapEDA_Link: https://www.snapeda.com/parts/DEV-15583/SparkFun%20Electronics/view-part/4001229/?ref=snap
Teensy4.1 = DEV-16771: RT1062 Teensy 4.1 series ARM® Cortex®-M7 MPU Embedded Evaluation Board; MF: SparkFun Electronics; SnapEDA_Link: https://www.snapeda.com/parts/DEV-16771/SparkFun+Electronics/view-part/?ref=snap; Package: None; Value: *; MP: DEV-16771; Check_prices: https://www.snapeda.com/parts/DEV-16771/SparkFun+Electronics/view-part/?ref=eda
VReg#2 = CMP-17439-000018-1: as Front_Sensor on sheet HotBox; ComponentLink2Description: Datasheet; Package: B04B-XASK-1(LF)(SN); Octopart: https://octopart.com/b04b-xask-1%28lf%29%28sn%29-jst-3990149; Pitch: 2.5mm; Device Class L1: Connectors; RoHS: TRUE; Device Class L3: unset; Manufacturer Part Number: B04B-XASK-1(LF)(SN); Temperature Range High: +85°C; Height: 8.8mm; Lead Free: Yes; Category: Conn; Temperature: -25°C to +85°C; Digikey Description: CONN HEADER VERT 4POS 2.5MM; Temperature Range Low: -25°C; ComponentLink2URL: http://www.jst-mfg.com/product/pdf/eng/eXA1.pdf; Contact Material: Tin,Copper; Device Class L2: Headers and Wire Housings; Automotive: No; Number Of Rows: 1

## Sheet DCT.SchDoc
size A3; SheetNumber: 1; SheetTotal: 1
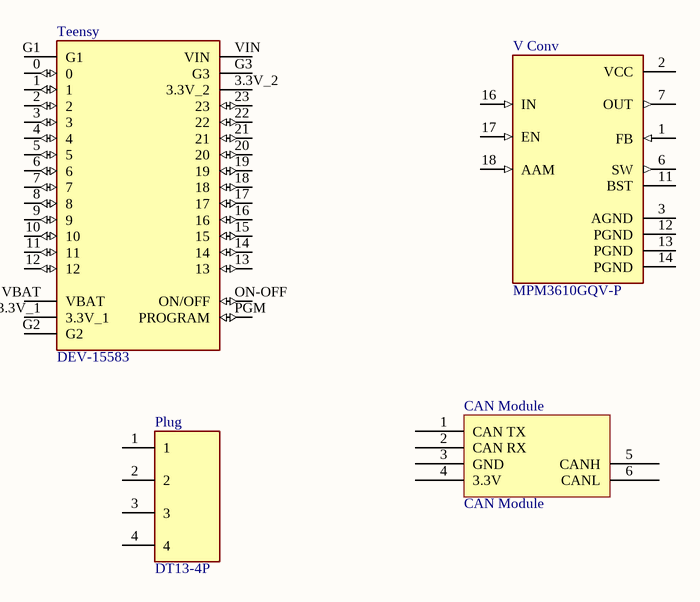
[diagram p4: DCT.SchDoc]

### Parts
(Parts that share a designator on the sheet are numbered #1, #2 ... from top to bottom, then left to right.)
CAN_Module#3  CAN Module  [CAN Module-Footprint-1]
Plug#2  DT13-4P  [TE_DT13-4P]
Teensy#2  DEV-15583  [MODULE_DEV-15583]
V_Conv  MPM3610GQV-P  [CONV_MPM3610GQV-P]

### Nets

Not connected (* = marked no-connect by the designer): CAN_Module#3 1(CAN_TX) 2(CAN_RX) 3(GND) 4(3.3V) 5(CANH) 6(CANL); Plug#2 1 2 3 4; Teensy#2 0 1 2 3 3.3V_1 3.3V_2 4 5 6 7 8 9 10 11 12 13 14 15 16 17 18 19 20 21 22 23 G1 G2 G3 ON-OFF(ON/OFF) PGM(PROGRAM) VBAT VIN; V_Conv 1(FB) 2(VCC) 3(AGND) 6(SW) 7(OUT) 11(BST) 12(PGND) 13(PGND) 14(PGND) 16(IN) 17(EN) 18(AAM)

### Library data of the parts
CAN_Module#3 = CMP-00030-00003-1: CAN waveshare
Plug#2 = DT13-4P: as 4P#1 on sheet HotBox; SnapEDA_Link: https://www.snapeda.com/parts/DT13-4P/TE%20Connectivity%20Deutsch%20Connectors/view-part/2708791/?ref=snap; MP: DT13-4P; TE_purchase_URL: https://www.te.com/usa-en/product-DT13-4P.html?te_bu=Cor&te_type=disp&te_campaign=seda_glo_cor-seda-global-disp-prtnr-fy19-seda-model-bom-cta_sma-317_1&elqCampaignId=32493; Availability: Unavailable; Value: *; Price: None; Package: None
Teensy#2 = DEV-15583: as Teensy#1 on sheet HotBox; Value: *; Package: None; Digi-Key_Part_Number: 1568-DEV-15583-ND; Digi-Key_Purchase_URL: https://www.digikey.com/product-detail/en/sparkfun-electronics/DEV-15583/1568-DEV-15583-ND/10384551?utm_source=snapeda&utm_medium=aggregator&utm_campaign=symbol; MP: DEV-15583; SnapEDA_Link: https://www.snapeda.com/parts/DEV-15583/SparkFun%20Electronics/view-part/4001229/?ref=snap
V_Conv = MPM3610GQV-P: Non-Isolated PoL Module DC DC Converter 1 Output 0.8 ~ 18.48V - - 1.2A 4.5V - 21V Input; MF: Monolithic Power; Package: QFN-20 MPS; Price: None; Check_prices: https://www.snapeda.com/parts/MPM3610GQV-P/Monolithic+Power+Systems+Inc./view-part/?ref=eda; Value: *; SnapEDA_Link: https://www.snapeda.com/parts/MPM3610GQV-P/Monolithic+Power+Systems+Inc./view-part/?ref=snap; MP: MPM3610GQV-P; Availability: In Stock; Purchase-URL: https://pricing.snapeda.com/search?q=MPM3610GQV-P&ref=eda

## Sheet DCR.SchDoc
size A; SheetNumber: 1; SheetTotal: 1
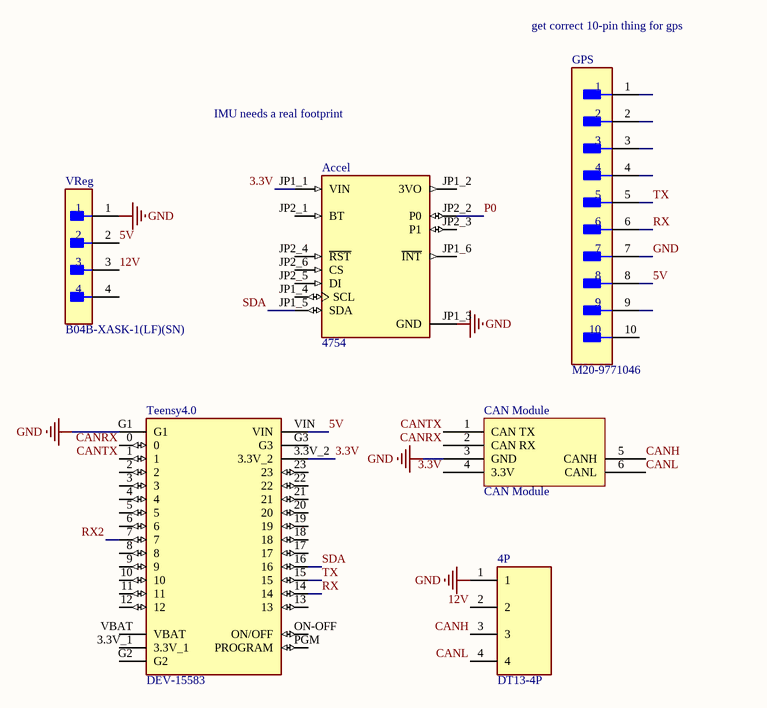
[diagram p5: DCR.SchDoc]

### Parts
(Parts that share a designator on the sheet are numbered #1, #2 ... from top to bottom, then left to right.)
4P#2  DT13-4P  [TE_DT13-4P]
Accel  4754  [MODULE_4754]
CAN_Module#4  CAN Module  [CAN Module-Footprint-1]
GPS  M20-9771046  [FP-M20-9771046-MFG]
Teensy4.0#2  DEV-15583  [MODULE_DEV-15583]
VReg#3  B04B-XASK-1(LF)(SN)  [FP-B04B-XASK-1_LF_SN-MFG]

### Nets
GND: 4P#2.1 Accel.JP1_3(GND) CAN_Module#4.3(GND) GPS.7 Teensy4.0#2.G1 VReg#3.1
3.3V: Accel.JP1_1(VIN) CAN_Module#4.4(3.3V) Teensy4.0#2.3.3V_2
5V: GPS.8 Teensy4.0#2.VIN VReg#3.2
12V: 4P#2.2 VReg#3.3
CANH: 4P#2.3 CAN_Module#4.5(CANH)
CANL: 4P#2.4 CAN_Module#4.6(CANL)
CANRX: CAN_Module#4.2(CAN_RX) Teensy4.0#2.0
CANTX: CAN_Module#4.1(CAN_TX) Teensy4.0#2.1
P0: Accel.JP2_2(P0)
RX: GPS.6 Teensy4.0#2.14
RX2: Teensy4.0#2.7
SDA: Accel.JP1_5(SDA) Teensy4.0#2.16
TX: GPS.5 Teensy4.0#2.15

Not connected (* = marked no-connect by the designer): Accel JP1_2(3VO) JP1_4(SCL) JP1_6(~{INT}) JP2_1(BT) JP2_3(P1) JP2_4(~{RST}) JP2_5(DI) JP2_6(CS); GPS 1 2 3 4 9 10; Teensy4.0#2 2 3 3.3V_1 4 5 6 8 9 10 11 12 13 17 18 19 20 21 22 23 G2 G3 ON-OFF(ON/OFF) PGM(PROGRAM) VBAT; VReg#3 4

### Notes on the sheet
- get correct 10-pin thing for gps
- IMU needs a real footprint

### Library data of the parts
4P#2 = DT13-4P: as 4P#1 on sheet HotBox; SnapEDA_Link: https://www.snapeda.com/parts/DT13-4P/TE%20Connectivity%20Deutsch%20Connectors/view-part/2708791/?ref=snap; MP: DT13-4P; TE_purchase_URL: https://www.te.com/usa-en/product-DT13-4P.html?te_bu=Cor&te_type=disp&te_campaign=seda_glo_cor-seda-global-disp-prtnr-fy19-seda-model-bom-cta_sma-317_1&elqCampaignId=32493; Availability: Unavailable; Value: *; Price: None; Package: None
Accel = 4754: Adafruit 9-DOF Orientation IMU Fusion Breakout - BNO085 (BNO080) - STEMMA QT / Qwiic; MP: 4754; SnapEDA_Link: https://www.snapeda.com/parts/4754/Adafruit+Industries/view-part/?ref=snap; Price: None; Purchase-URL: https://pricing.snapeda.com/search/part/4754/?ref=eda; MF: Adafruit; Package: None; Availability: In Stock; Check_prices: https://www.snapeda.com/parts/4754/Adafruit+Industries/view-part/?ref=eda; Value: *
CAN_Module#4 = CMP-00030-00003-1: CAN waveshare
GPS = CMP-15831-000029-1: CONN HEADER VERT 10POS 2.54MM; Gender: Male; Number of Positions: 10; Connector Type: Male Pin; Voltage Rating: 750V; Current Rating: 3A; Contact Plating: Tin; Mount: Through Hole; Radiation Hardening: No; Packaging: Bulk; Pitch: 2.54mm; Number of Rows: 1; Series: M20; Contact Type: Male Pin; Color: Black; Package Quantity: 500; Contact Mating Length: 0.228inch; Case/Package: SIL; Termination: Solder; Number of Contacts: 10; Housing Material: Nylon; Contact Material: Brass
Teensy4.0#2 = DEV-15583: as Teensy#1 on sheet HotBox; Value: *; Package: None; Digi-Key_Part_Number: 1568-DEV-15583-ND; Digi-Key_Purchase_URL: https://www.digikey.com/product-detail/en/sparkfun-electronics/DEV-15583/1568-DEV-15583-ND/10384551?utm_source=snapeda&utm_medium=aggregator&utm_campaign=symbol; MP: DEV-15583; SnapEDA_Link: https://www.snapeda.com/parts/DEV-15583/SparkFun%20Electronics/view-part/4001229/?ref=snap
VReg#3 = CMP-17439-000018-1: as Front_Sensor on sheet HotBox; ComponentLink2Description: Datasheet; Package: B04B-XASK-1(LF)(SN); Octopart: https://octopart.com/b04b-xask-1%28lf%29%28sn%29-jst-3990149; Pitch: 2.5mm; Device Class L1: Connectors; RoHS: TRUE; Device Class L3: unset; Manufacturer Part Number: B04B-XASK-1(LF)(SN); Temperature Range High: +85°C; Height: 8.8mm; Lead Free: Yes; Category: Conn; Temperature: -25°C to +85°C; Digikey Description: CONN HEADER VERT 4POS 2.5MM; Temperature Range Low: -25°C; ComponentLink2URL: http://www.jst-mfg.com/product/pdf/eng/eXA1.pdf; Contact Material: Tin,Copper; Device Class L2: Headers and Wire Housings; Automotive: No; Number Of Rows: 1

## Nets that join several sheets
GND: BSPD (30 pins), HotBox (6 pins), WOX (6 pins), DCF-ECU (20 pins), DCR (6 pins)
3.3V: WOX (CAN_Module#2.4 Teensy4.0#1.3.3V_2), DCF-ECU (11 pins), DCR (Accel.JP1_1 CAN_Module#4.4 Teensy4.0#2.3.3V_2)
5V: WOX (MPM3610.3 Teensy4.0#1.VIN), DCF-ECU (Teensy4.VIN Teensy4.1.VIN VReg#2.3), DCR (GPS.8 Teensy4.0#2.VIN VReg#3.2)
12V: BSPD (16 pins), WOX (MPM3610.2 Standard.2), DCF-ECU (2P_BL.1 2P_Horn.1 6P.2 VReg#2.2), DCR (4P#2.2 VReg#3.3)
CANH: WOX (CAN_Module#2.5 Standard.4), DCR (4P#2.3 CAN_Module#4.5)
CANL: WOX (CAN_Module#2.6 Standard.3), DCR (4P#2.4 CAN_Module#4.6)